# Altium schematic sheet Power Path ControllersRev2.SchDoc
size E
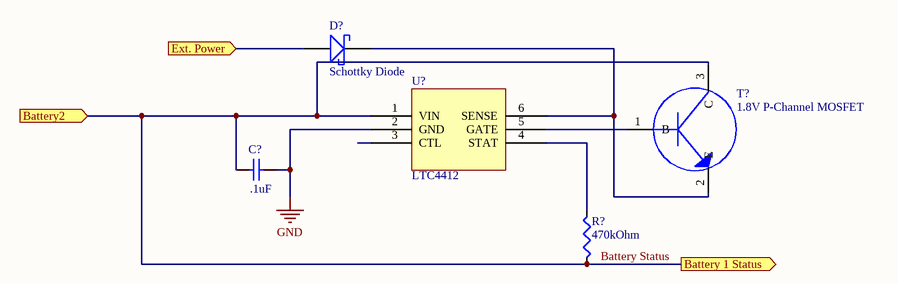
[diagram p0: Power Path ControllersRev2.SchDoc]

## Parts
C?  .1uF  [0805 (2012) Capacitor]
D?  Schottky Diode  [DO-41]
R?  470kOhm  [R 0805 (2012) RESISTOR]
T?  1.8V P-Channel MOSFET  [SOT23]
U?  LTC4412  [SOT95P245X110-6N]

## Ports
Battery2 (in), Battery 1 Status (out), Ext. Power (in)

## Nets
GND: C?.2 U?.2(GND)
Battery Status: C?.1 R?.1 T?.3(C) U?.1(VIN) ; port Battery 1 Status, port Battery2
Ext. Power: D?.A ; port Ext. Power
NetD?_K: D?.K T?.2(E) U?.6(SENSE)
NetR?_2: R?.2 U?.4(STAT)
NetT?_1: T?.1(B) U?.5(GATE)

Not connected (* = marked no-connect by the designer): U? 3(CTL)

## Library data of the parts
C? = Capacitor (non-polarized): Capacitor; Value: .1uF
R? = Resistor: Value: 0Ohm
T? = Transistor
U? = LTC4412: Low Loss Power Path Controller in Thin SOT